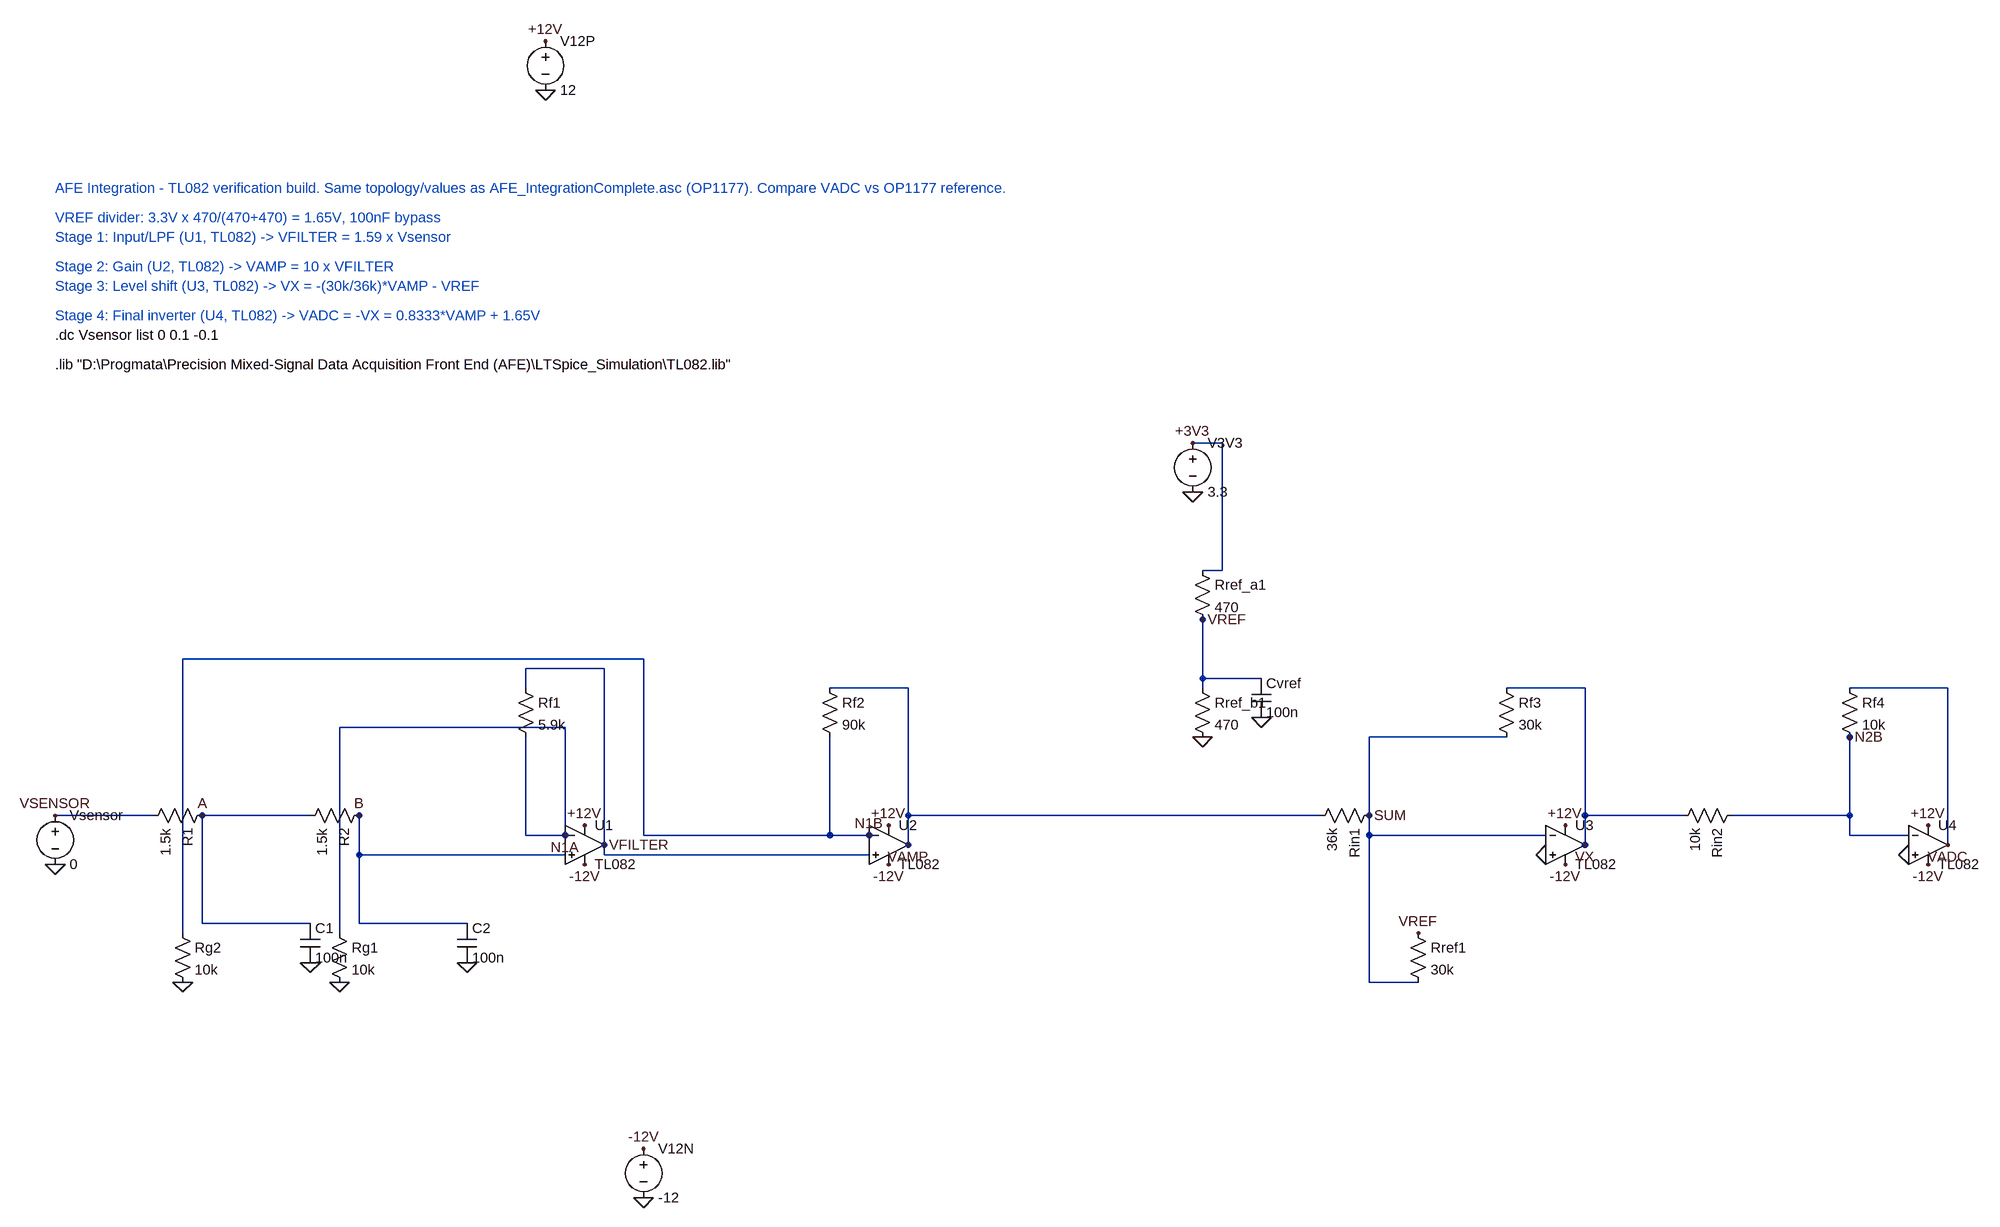
[diagram p0: schematic AFE_Integration_TL082.asc]
AFE_Integration_TL082.asc, the LTspice schematic file:
Version 4
SHEET 1 3400 1000
WIRE -256 320 -96 320
WIRE -16 320 160 320
WIRE -16 320 -16 496
WIRE -16 496 160 496
WIRE 240 320 240 496
WIRE 240 496 416 496
WIRE 240 320 240 384
WIRE 240 384 576 384
WIRE 576 352 576 176
WIRE 576 176 208 176
WIRE 208 176 208 512
WIRE 576 352 512 352
WIRE 512 352 512 192
WIRE 640 368 640 80
WIRE 640 80 512 80
WIRE 512 80 512 112
WIRE 640 368 640 384
WIRE 640 384 1072 384
WIRE 1072 352 704 352
WIRE 704 352 704 64
WIRE 704 64 -48 64
WIRE -48 64 -48 512
WIRE 1072 352 1008 352
WIRE 1008 352 1008 192
WIRE 1136 368 1136 112
WIRE 1136 112 1008 112
WIRE 1136 368 1136 320
WIRE 1136 320 1808 320
WIRE 1600 -288 1648 -288
WIRE 1648 -288 1648 -80
WIRE 1648 -80 1616 -80
WIRE 1616 0 1616 112
WIRE 1616 0 1616 96
WIRE 1616 96 1712 96
WIRE 1888 320 1888 592
WIRE 1888 592 1968 592
WIRE 1888 320 1888 192
WIRE 1888 192 2112 192
WIRE 1888 320 1888 352
WIRE 1888 352 2176 352
WIRE 2240 368 2240 112
WIRE 2240 112 2112 112
WIRE 2240 368 2240 320
WIRE 2240 320 2400 320
WIRE 2672 192 2672 352
WIRE 2672 352 2768 352
WIRE 2672 192 2672 320
WIRE 2672 320 2480 320
WIRE 2832 368 2832 112
WIRE 2832 112 2672 112
FLAG -256 320 VSENSOR
FLAG -16 320 A
FLAG 240 320 B
FLAG 576 352 N1A
FLAG 640 368 VFILTER
FLAG 1072 352 N1B
FLAG 1136 368 VAMP
FLAG 1600 -288 +3V3
FLAG 1616 0 VREF
FLAG 1968 512 VREF
FLAG 1888 320 SUM
FLAG 2240 368 VX
FLAG 2672 192 N2B
FLAG 2832 368 VADC
FLAG 544 -944 +12V
FLAG 704 864 -12V
FLAG 608 336 +12V
FLAG 608 400 -12V
FLAG 1104 336 +12V
FLAG 1104 400 -12V
FLAG 2208 336 +12V
FLAG 2208 400 -12V
FLAG 2800 336 +12V
FLAG 2800 400 -12V
FLAG -256 400 0
FLAG 544 -864 0
FLAG 704 944 0
FLAG 1600 -208 0
FLAG 160 560 0
FLAG 416 560 0
FLAG 208 592 0
FLAG -48 592 0
FLAG 1616 192 0
FLAG 1712 160 0
FLAG 2176 384 0
FLAG 2768 384 0
SYMBOL voltage -256 304 R0
SYMATTR InstName Vsensor
SYMATTR Value 0
SYMBOL voltage 544 -960 R0
SYMATTR InstName V12P
SYMATTR Value 12
SYMBOL voltage 704 848 R0
SYMATTR InstName V12N
SYMATTR Value -12
SYMBOL voltage 1600 -304 R0
SYMATTR InstName V3V3
SYMATTR Value 3.3
SYMBOL res 0 304 R90
SYMATTR InstName R1
SYMATTR Value 1.5k
SYMBOL cap 144 496 R0
SYMATTR InstName C1
SYMATTR Value 100n
SYMBOL res 256 304 R90
SYMATTR InstName R2
SYMATTR Value 1.5k
SYMBOL cap 400 496 R0
SYMATTR InstName C2
SYMATTR Value 100n
SYMBOL opamp2 608 304 R0
SYMATTR InstName U1
SYMATTR Value TL082
SYMBOL res 192 496 R0
SYMATTR InstName Rg1
SYMATTR Value 10k
SYMBOL res 496 96 R0
SYMATTR InstName Rf1
SYMATTR Value 5.9k
SYMBOL opamp2 1104 304 R0
SYMATTR InstName U2
SYMATTR Value TL082
SYMBOL res -64 496 R0
SYMATTR InstName Rg2
SYMATTR Value 10k
SYMBOL res 992 96 R0
SYMATTR InstName Rf2
SYMATTR Value 90k
SYMBOL res 1600 -96 R0
SYMATTR InstName Rref_a1
SYMATTR Value 470
SYMBOL res 1600 96 R0
SYMATTR InstName Rref_b1
SYMATTR Value 470
SYMBOL cap 1696 96 R0
SYMATTR InstName Cvref
SYMATTR Value 100n
SYMBOL res 1904 304 R90
SYMATTR InstName Rin1
SYMATTR Value 36k
SYMBOL res 1952 496 R0
SYMATTR InstName Rref1
SYMATTR Value 30k
SYMBOL res 2096 96 R0
SYMATTR InstName Rf3
SYMATTR Value 30k
SYMBOL opamp2 2208 304 R0
SYMATTR InstName U3
SYMATTR Value TL082
SYMBOL res 2496 304 R90
SYMATTR InstName Rin2
SYMATTR Value 10k
SYMBOL res 2656 96 R0
SYMATTR InstName Rf4
SYMATTR Value 10k
SYMBOL opamp2 2800 304 R0
SYMATTR InstName U4
SYMATTR Value TL082
TEXT -256 -704 Left 2 ;AFE Integration - TL082 verification build. Same topology/values as AFE_IntegrationComplete.asc (OP1177). Compare VADC vs OP1177 reference.
TEXT -256 -656 Left 2 ;VREF divider: 3.3V x 470/(470+470) = 1.65V, 100nF bypass
TEXT -256 -624 Left 2 ;Stage 1: Input/LPF (U1, TL082) -> VFILTER = 1.59 x Vsensor
TEXT -256 -576 Left 2 ;Stage 2: Gain (U2, TL082) -> VAMP = 10 x VFILTER
TEXT -256 -544 Left 2 ;Stage 3: Level shift (U3, TL082) -> VX = -(30k/36k)*VAMP - VREF
TEXT -256 -496 Left 2 ;Stage 4: Final inverter (U4, TL082) -> VADC = -VX = 0.8333*VAMP + 1.65V
TEXT -256 -464 Left 2 !.dc Vsensor list 0 0.1 -0.1
TEXT -256 -416 Left 2 !.lib "D:\Progmata\Precision Mixed-Signal Data Acquisition Front End (AFE)\LTSpice_Simulation\TL082.lib"

The netlist it stands for:
* AFE_Integration_TL082.asc
Vsensor VSENSOR 0 0
V12P +12V 0 12
V12N -12V 0 -12
V3V3 +3V3 0 3.3
R1 A VSENSOR 1.5k
C1 A 0 100n
R2 B A 1.5k
C2 B 0 100n
XU1 B N1A +12V -12V VFILTER TL082  ; pins In+ In- V+ V- OUT
Rg1 N1A 0 10k
Rf1 VFILTER N1A 5.9k
XU2 VFILTER N1B +12V -12V VAMP TL082  ; pins In+ In- V+ V- OUT
Rg2 N1B 0 10k
Rf2 VAMP N1B 90k
Rref_a1 +3V3 VREF 470
Rref_b1 VREF 0 470
Cvref VREF 0 100n
Rin1 SUM VAMP 36k
Rref1 VREF SUM 30k
Rf3 VX SUM 30k
XU3 0 SUM +12V -12V VX TL082  ; pins In+ In- V+ V- OUT
Rin2 N2B VX 10k
Rf4 VADC N2B 10k
XU4 0 N2B +12V -12V VADC TL082  ; pins In+ In- V+ V- OUT
* AFE Integration - TL082 verification build. Same topology/values as AFE_IntegrationComplete.asc (OP1177). Compare VADC vs OP1177 reference.
* VREF divider: 3.3V x 470/(470+470) = 1.65V, 100nF bypass
* Stage 1: Input/LPF (U1, TL082) -> VFILTER = 1.59 x Vsensor
* Stage 2: Gain (U2, TL082) -> VAMP = 10 x VFILTER
* Stage 3: Level shift (U3, TL082) -> VX = -(30k/36k)*VAMP - VREF
* Stage 4: Final inverter (U4, TL082) -> VADC = -VX = 0.8333*VAMP + 1.65V
.dc Vsensor list 0 0.1 -0.1
.lib "D:\Progmata\Precision Mixed-Signal Data Acquisition Front End (AFE)\LTSpice_Simulation\TL082.lib"
.backanno
.end

* Results of the author's LTspice run, read from the files saved beside the schematic
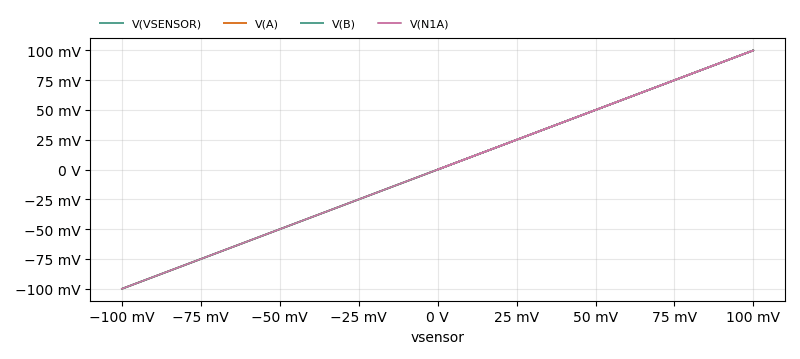
[diagram p1: DC transfer characteristic of AFE_Integration_TL082.asc, plotted from the saved traces]
* DC transfer characteristic, 1 run:
*   V(VSENSOR): 0 V at vsensor=0 V, -100 mV at vsensor=-100 mV, min -100 mV, max 100 mV
*   V(A): -63.08 nV at vsensor=0 V, -100 mV at vsensor=-100 mV, min -100 mV, max 100 mV
*   V(B): -126.2 nV at vsensor=0 V, -100 mV at vsensor=-100 mV, min -100 mV, max 100 mV
*   V(N1A): 10.84 µV at vsensor=0 V, -99.99 mV at vsensor=-100 mV, min -99.99 mV, max 100 mV